# EAGLE design 14-pin SOIC+TSSOP (EAGLE 6.2)
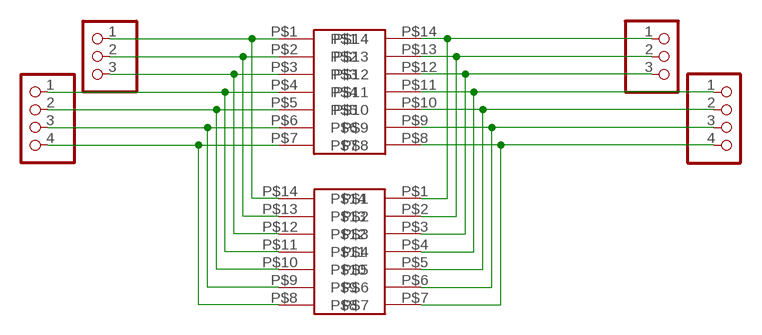
[diagram p0: schematic, sheet 1]

## Parts
JP1  PADS-3  [PADS-3]
JP2  PADS-3  [PADS-3]
JP3  PADS-4  [PADS-4]
JP4  PADS-4  [PADS-4]
U$1  14-PINSOIC-NW  [SO14-NW]
U$2  14-PINTSSOP-NW  [TSSOP14-NW]

## Nets
N$1: JP2.1 U$1.P$1 U$2.P$14
N$2: JP2.2 U$1.P$2 U$2.P$13
N$3: JP2.3 U$1.P$3 U$2.P$12
N$4: JP4.1 U$1.P$4 U$2.P$11
N$5: JP4.2 U$1.P$5 U$2.P$10
N$6: JP4.3 U$1.P$6 U$2.P$9
N$7: JP4.4 U$1.P$7 U$2.P$8
N$8: JP1.1 U$1.P$14 U$2.P$1
N$9: JP1.2 U$1.P$13 U$2.P$2
N$10: JP1.3 U$1.P$12 U$2.P$3
N$11: JP3.1 U$1.P$11 U$2.P$4
N$12: JP3.2 U$1.P$10 U$2.P$5
N$13: JP3.3 U$1.P$9 U$2.P$6
N$14: JP3.4 U$1.P$8 U$2.P$7

## Library data of the parts
JP1 JP2 = breakouts:PADS-3: PIN HEADER
JP3 JP4 = breakouts:PADS-4: PIN HEADER
U$1 U$2 = breakouts:14-PIN

## Board
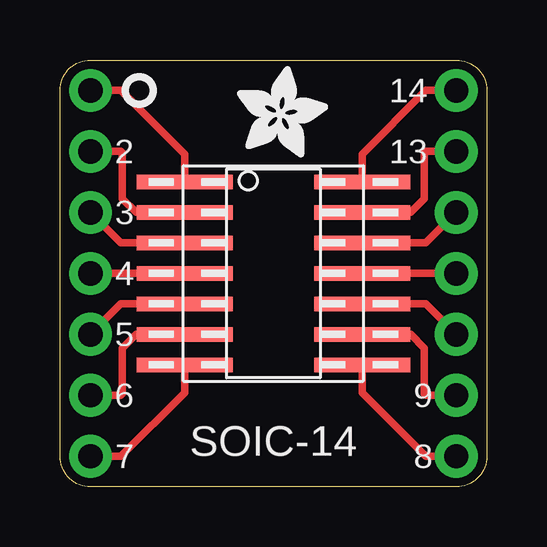
[diagram p1: board, top side]
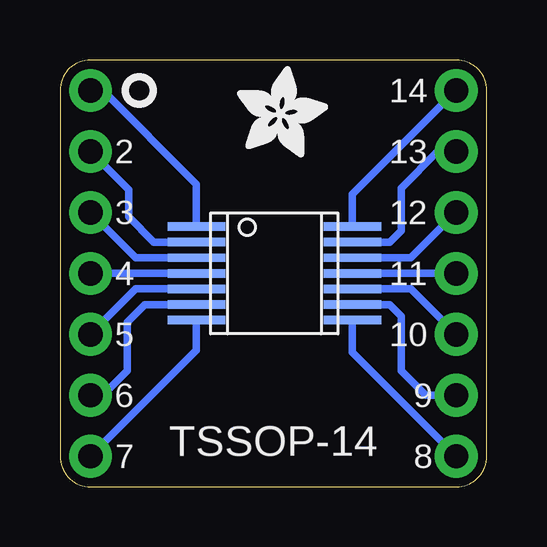
[diagram p2: board, bottom side, seen from below]

Size 17.78 x 17.78 mm. Coordinates in mm from the lower left corner, seen from the top.
Outline: 0,1.27 0,16.51 arc-90 1.27,17.78 16.51,17.78 arc-90 17.78,16.51 17.78,1.27 arc-90 16.51,0 1.27,0 arc-90 0,1.27
Copper layers (1*16): Top 0.035mm / dielectric 1.5mm / Bottom 0.035mm
Design rules: minimum track width 10mil, minimum drill 24mil, track to track 8mil, track to pad 8mil, pad to pad 8mil, via to via 8mil, smd to smd 8mil, copper to edge 40mil, drill to drill 8mil, minimum pad ring 10mil, minimum via ring 8mil, stop-mask expansion 4mil, vias tented up to drill 0mil, thermal gap 10mil

### Footprints (pad centres in the part's own frame; a part is rotated, then mirrored left to right if it is on the bottom)
PADS-3 = drill 1.016 pad 1.778: 1 -2.54,0; 2 0,0; 3 2.54,0
PADS-4 = drill 1.016 pad 1.778: 1 -3.81,0; 2 -1.27,0; 3 1.27,0; 4 3.81,0
SO14-NW = smd 4 x 0.6: P$1 -3.7,3.81; P$2 -3.7,2.54; P$3 -3.7,1.27; P$4 -3.7,0; P$5 -3.7,-1.27; P$6 -3.7,-2.54; P$7 -3.7,-3.81; P$8 3.7,-3.81; P$9 3.7,-2.54; P$10 3.7,-1.27; P$11 3.7,0; P$12 3.7,1.27; P$13 3.7,2.54; P$14 3.7,3.81
TSSOP14-NW = smd 2.4 x 0.35: P$1 -3.21,1.95; P$2 -3.21,1.3; P$3 -3.21,0.65; P$4 -3.21,0; P$5 -3.21,-0.65; P$6 -3.21,-1.3; P$7 -3.21,-1.95; P$8 3.29,-1.95; P$9 3.29,-1.3; P$10 3.29,-0.65; P$11 3.29,0; P$12 3.29,0.65; P$13 3.29,1.3; P$14 3.29,1.95

### Placement (x,y rotation side)
JP1  16.51,13.97 270 top
JP2  1.27,13.97 270 top
JP3  16.51,5.08 270 top
JP4  1.27,5.08 270 top
U$1  8.89,8.89 0 top
U$2  8.89,8.89 0 bottom
U$3  [ADAFRUIT_3.5MM]  7.37,13.72 0 top
U$4  [ADAFRUIT_3.5MM]  10.41,13.72 0 bottom

### Tracks (layer width: path | path; a pad name or v marks a point on that pad's centre or on a via)
N$1
  Top 0.305: U$1.P$1 5.19,13.86 2.54,16.51 JP2.1
  Bottom 0.305: U$2.P$14 5.6,12.18 JP2.1
N$2
  Top 0.305: U$1.P$2 3.17,11.43 2.6,12 2.6,13.91 2.54,13.97 JP2.2
  Bottom 0.305: U$2.P$13 4.03,10.19 3.56,10.67 3.56,12.45 2.03,13.97 JP2.2
N$3
  Top 0.305: U$1.P$3 2.54,10.16 JP2.3
  Bottom 0.305: U$2.P$12 3.16,9.54 JP2.3
N$4
  Top 0.305: U$1.P$4 JP4.1
  Bottom 0.305: U$2.P$11 JP4.1
N$5
  Top 0.305: U$1.P$5 2.54,7.62 JP4.2
  Bottom 0.305: U$2.P$10 3.16,8.24 JP4.2
N$6
  Top 0.305: U$1.P$6 3.17,6.35 2.6,5.78 2.6,3.87 2.54,3.81 JP4.3
  Bottom 0.305: U$2.P$9 4.03,7.59 3.56,7.11 3.56,4.83 2.54,3.81 JP4.3
N$7
  Top 0.305: U$1.P$7 5.19,3.92 2.54,1.27 JP4.4
  Bottom 0.305: U$2.P$8 5.6,5.6 JP4.4
N$8
  Top 0.305: U$1.P$14 12.59,13.86 15.24,16.51 JP1.1
  Bottom 0.305: U$2.P$1 12.1,12.61 16,16.51 JP1.1
N$9
  Top 0.305: U$1.P$13 14.61,11.43 15.18,12 15.18,13.91 15.24,13.97 JP1.2
  Bottom 0.305: U$2.P$2 13.87,10.19 14.92,11.24 14.92,12.38 JP1.2
N$10
  Top 0.305: U$1.P$12 15.24,10.16 JP1.3
  Bottom 0.305: U$2.P$3 14.62,9.54 JP1.3
N$11
  Top 0.305: U$1.P$11 JP3.1
  Bottom 0.305: U$2.P$4 JP3.1
N$12
  Top 0.305: U$1.P$10 15.24,7.62 JP3.2
  Bottom 0.305: U$2.P$5 14.62,8.24 JP3.2
N$13
  Top 0.305: U$1.P$9 14.61,6.35 15.18,5.78 15.18,3.87 15.24,3.81 JP3.3
  Bottom 0.305: U$2.P$6 14.25,7.59 14.99,6.86 14.99,4.83 16,3.81 JP3.3
N$14
  Top 0.305: U$1.P$8 12.59,3.92 15.24,1.27 JP3.4
  Bottom 0.305: U$2.P$7 12.1,5.68 JP3.4

### Text on the board
tPlace: 14 | 2 | 13 | 3 | 4 | 5 | 6 | 9 | 7 | SOIC-14 | 8
bPlace: 14 | 13 | 2 | 12 | 3 | 11 | 4 | 10 | 5 | 9 | 6 | 8 | TSSOP-14 | 7